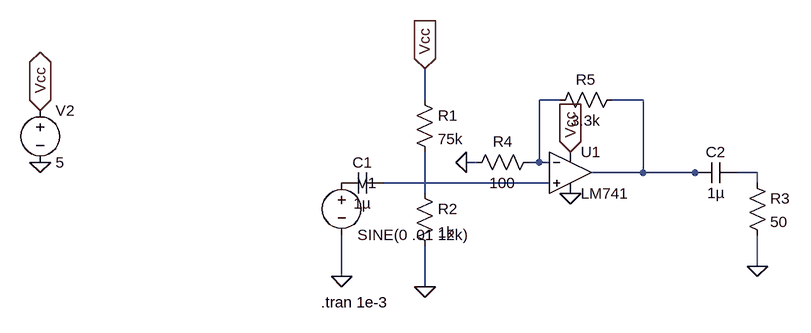
[diagram p0: schematic Amplifier.asc]
Amplifier.asc, the LTspice schematic file:
Version 4.1
SHEET 1 880 680
WIRE -144 48 -144 0
WIRE 64 48 32 48
WIRE 192 48 144 48
WIRE -64 144 -80 144
WIRE 32 144 32 48
WIRE 32 144 16 144
WIRE 48 144 32 144
WIRE 192 160 192 48
WIRE 192 160 112 160
WIRE 272 160 192 160
WIRE 288 160 272 160
WIRE 368 160 336 160
WIRE 48 176 -208 176
WIRE 368 176 368 160
WIRE -144 192 -144 128
WIRE 368 304 368 256
WIRE -272 320 -272 256
WIRE -144 336 -144 272
FLAG 80 128 Vcc
IOPIN 80 128 In
FLAG 80 192 0
FLAG -144 0 Vcc
IOPIN -144 0 In
FLAG -144 336 0
FLAG 368 304 0
FLAG -80 144 0
FLAG -272 320 0
FLAG -736 144 0
FLAG -736 64 Vcc
IOPIN -736 64 BiDir
SYMBOL LM741 80 96 R0
SYMATTR InstName U1
SYMBOL res -160 32 R0
SYMATTR InstName R1
SYMATTR Value 75k
SYMBOL res -160 176 R0
SYMATTR InstName R2
SYMATTR Value 1k
SYMBOL cap -208 160 R90
WINDOW 0 0 32 VBottom 2
WINDOW 3 32 32 VTop 2
SYMATTR InstName C1
SYMATTR Value 1µ
SYMBOL cap 336 144 R90
WINDOW 0 0 32 VBottom 2
WINDOW 3 32 32 VTop 2
SYMATTR InstName C2
SYMATTR Value 1µ
SYMBOL res 32 128 R90
WINDOW 0 0 56 VBottom 2
WINDOW 3 32 56 VTop 2
SYMATTR InstName R4
SYMATTR Value 100
SYMBOL res 160 32 R90
WINDOW 0 0 56 VBottom 2
WINDOW 3 32 56 VTop 2
SYMATTR InstName R5
SYMATTR Value 3.3k
SYMBOL voltage -272 160 R0
WINDOW 123 0 0 Left 0
WINDOW 39 0 0 Left 0
SYMATTR InstName V1
SYMATTR Value SINE(0 .01 12k)
SYMBOL voltage -736 48 R0
WINDOW 123 0 0 Left 0
WINDOW 39 0 0 Left 0
SYMATTR InstName V2
SYMATTR Value 5
SYMBOL res 352 160 R0
SYMATTR InstName R3
SYMATTR Value 50
TEXT -304 360 Left 2 !.tran 1e-3

The netlist it stands for:
* Amplifier.asc
X§U1 N004 N001 Vcc 0 N002 LM741  ; pins In+ In- V+ V- OUT
R1 Vcc N005 75k
R2 N005 0 1k
C1 N004 P001 1µ
C2 N003 N002 1µ
R4 N001 0 100
R5 N002 N001 3.3k
V1 P001 0 SINE(0 .01 12k)
V2 Vcc 0 5
R3 N003 0 50
.tran 1e-3
.lib LM741.lib
.backanno
.end